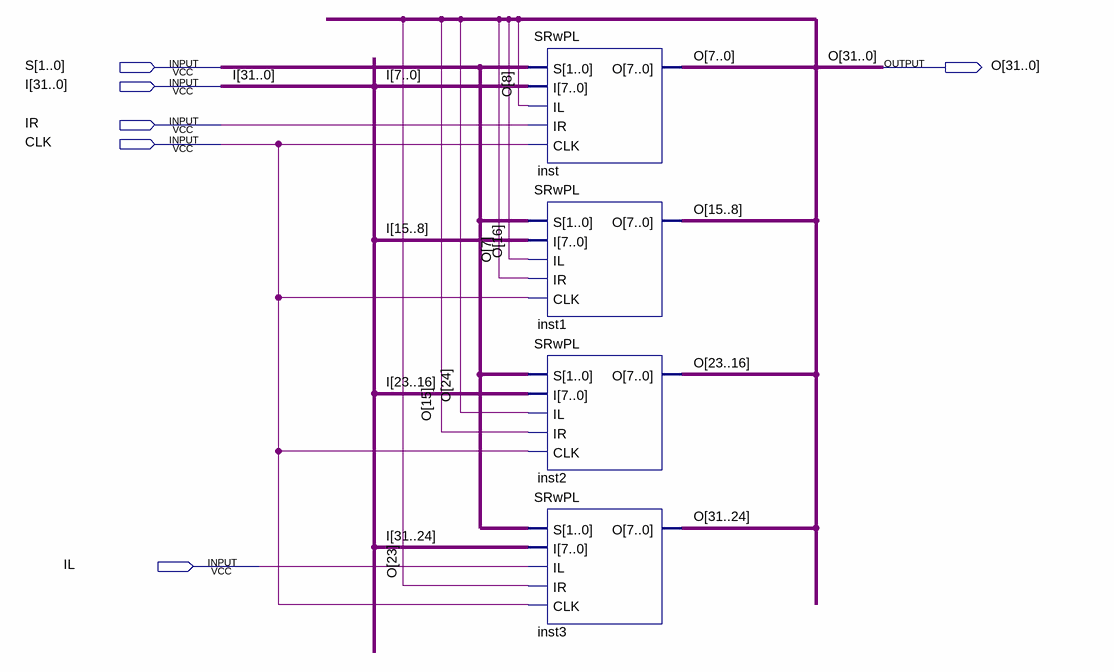
[diagram p0: schematic sheet]
// Quartus schematic SRwPL_32bit.bdf as structural Verilog: 4 symbols, 6 pins
module SRwPL_32bit (
  input  [1:0] S,
  input  [31:0] I,
  input  IR,
  input  CLK,
  input  IL,
  output [31:0] O
);

  SRwPL inst (.S(S), .I(I[7:0]), .IL(O[8]), .IR(IR), .CLK(CLK), .O(O[7:0]));
  SRwPL inst1 (.S(S), .I(I[15:8]), .IL(O[16]), .IR(O[7]), .CLK(CLK), .O(O[15:8]));
  SRwPL inst2 (.S(S), .I(I[23:16]), .IL(O[24]), .IR(O[15]), .CLK(CLK), .O(O[23:16]));
  SRwPL inst3 (.S(S), .I(I[31:24]), .IL(IL), .IR(O[23]), .CLK(CLK), .O(O[31:24]));
endmodule
